# Altium project Buck converter.PrjPcb
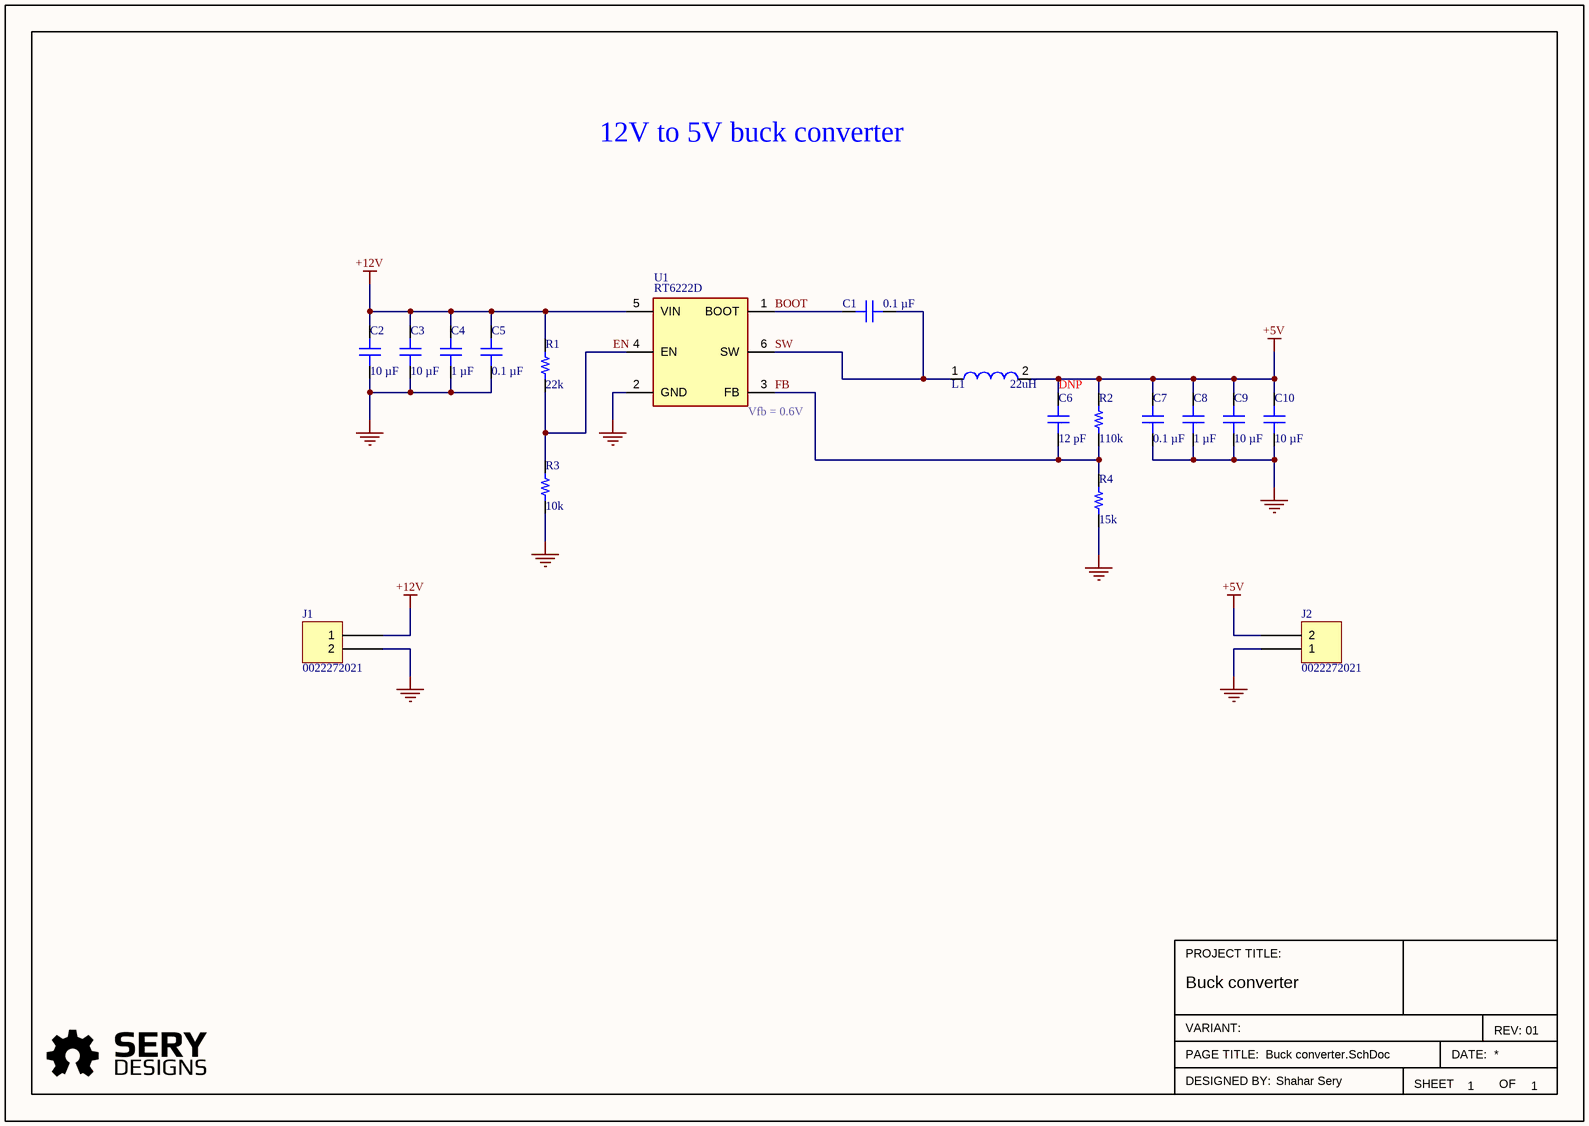
[diagram p0: Buck converter.SchDoc]
drawnby: Shahar Sery; project: Buck converter; revision: 01
1 sheet, 20 parts. Net scope: global (net labels, ports and power ports of the same name join across sheets).
Board file: Buck converter.PcbDoc

## Sheet Buck converter.SchDoc
size 297 x 209 mm; SheetNumber: 1; SheetTotal: 1

### Parts
C1  0.1 µF  [CAP 0402_1005]
C2  10 µF  [CAP 0805_2012]
C3  10 µF  [CAP 0805_2012]
C4  1 µF  [CAP 0603_1608]
C5  0.1 µF  [CAP 0402_1005]
C6  12 pF  [CAP 0402_1005]
C7  0.1 µF  [CAP 0402_1005]
C8  1 µF  [CAP 0603_1608]
C9  10 µF  [CAP 0805_2012]
C10  10 µF  [CAP 0805_2012]
J1  0022272021  [MOLEX KK 0022272021]
J2  0022272021  [MOLEX KK 0022272021]
L1  22uH  [NRS8040T220MJGJV]
OSHW-logo1  OSHW-logo  [OSHW-logo]  (value not drawn)  (no BOM)
R1  22k  [RES 0402_1005]
R2  110k  [RES 0402_1005]
R3  10k  [RES 0402_1005]
R4  15k  [RES 0402_1005]
SeryDesigns-logo1  SeryDesigns-logo  [SeryDesigns-logo]  (value not drawn)  (no BOM)
U1  RT6222D  [sot23-6]

### Nets
+5V: C6.2 C7.2 C8.2 C9.2 C10.2 J2.2 L1.2 R2.2
+12V: C2.2 C3.2 C4.2 C5.2 J1.1 R1.2 U1.5(VIN)
GND: C2.1 C3.1 C4.1 C5.1 C7.1 C8.1 C9.1 C10.1 J1.2 J2.1 R3.1 R4.1 U1.2(GND)
BOOT: C1.2 U1.1(BOOT)
EN: R1.1 R3.2 U1.4(EN)
FB: C6.1 R2.1 R4.2 U1.3(FB)
SW: C1.1 L1.1 U1.6(SW)

### Notes on the sheet
- 12V to 5V buck converter
- (near C6) DNP
- (near U1) Vfb = 0.6V
- PROJECT TITLE:
- VARIANT:
- PAGE TITLE:
- SHEET
- DATE:
- REV:
- OF
- DESIGNED BY:

### Library data of the parts
C1 C5 C7 = GRT155R71H104KE01D: CAP CER 0.1UF 50V X7R 0402; manufacturer: Murata Electronics; Tolerance: ±10%; Part Number: GRT155R71H104KE01D; Value: 0.1 µF; Applications: Automotive; Capacitance: 0.1 µF; componentlink2description: DigiKey Link; componentlink2url: https://www.digikey.com/en/products/detail/murata-electronics/GRT155R71H104KE01D/10704679; Device Package: 0402 (1005 Metric); lastupdated: 9/19/2022 12:56:46 PM; Lifecycle Status: Active; Minimum Order: 1; Mounting Type: Surface Mount, MLCC; Operating Temperature: -55°C ~ 125°C; Package / Case: 0402 (1005 Metric); packaging: TapeAndReel; partid: 44223; Part Status: Active; price: 0.01; Ratings: AEC-Q200; series: GRT; Size / Dimension: 0.039" L x 0.020" W (1.00mm x 0.50mm); Supplier 1: DigiKey; Supplier Part Number 1: 490-GRT155R71H104KE01DCT-ND; Temperature Coefficient: X7R; Thickness (Max): 0.022" (0.55mm); Voltage - Rated: 50V
C2 C3 C9 C10 = GRM21BR61H106ME43L: CAP CER 10UF 50V X5R 0805; manufacturer: Murata Electronics; Tolerance: ±20%; Part Number: GRM21BR61H106ME43L; Value: 10 µF; Applications: General Purpose; Capacitance: 10 µF; componentlink1description: Datasheet; componentlink1url: https://search.murata.co.jp/Ceramy/image/img/A01X/G101/ENG/GRM21BR61H106ME43-01A.pdf; componentlink2description: DigiKey Link; componentlink2url: https://www.digikey.com/en/products/detail/murata-electronics/GRM21BR61H106ME43L/10326317; Device Package: 0805 (2012 Metric); lastupdated: 9/19/2022 1:04:12 PM; Lifecycle Status: Active; Minimum Order: 1; Mounting Type: Surface Mount, MLCC; Operating Temperature: -55°C ~ 85°C; Package / Case: 0805 (2012 Metric); packaging: TapeAndReel; partid: 41295; Part Status: Active; price: 0.08; series: GRM; Size / Dimension: 0.079" L x 0.049" W (2.00mm x 1.25mm); Supplier 1: DigiKey; Supplier Part Number 1: 490-18664-1-ND; Temperature Coefficient: X5R; Thickness (Max): 0.057" (1.45mm); Voltage - Rated: 50V
C4 C8 = UMK107AB7105KA-T: CAP CER 1UF 50V X7R 0603; manufacturer: Taiyo Yuden; Tolerance: ±10%; Part Number: UMK107AB7105KA-T; Value: 1 µF; Applications: SMPS Filtering; Capacitance: 1 µF; componentlink1description: Datasheet; componentlink1url: https://www.yuden.co.jp/productdata/catalog/mlcc01_e.pdf; componentlink2description: DigiKey Link; componentlink2url: https://www.digikey.com/en/products/detail/taiyo-yuden/UMK107AB7105KA-T/3660085; Device Package: 0603 (1608 Metric); lastupdated: 9/19/2022 1:00:51 PM; Lifecycle Status: Active; Minimum Order: 1; Mounting Type: Surface Mount, MLCC; Operating Temperature: -55°C ~ 125°C; Package / Case: 0603 (1608 Metric); packaging: TapeAndReel; partid: 46688; Part Status: Active; price: 0.04; series: M; Size / Dimension: 0.063" L x 0.031" W (1.60mm x 0.80mm); Supplier 1: DigiKey; Supplier Part Number 1: 587-3247-1-ND; Temperature Coefficient: X7R; Thickness (Max): 0.037" (0.95mm); Voltage - Rated: 50V
C6 = GCM1555C1H120JA16D: CAP CER 12PF 50V C0G/NP0 0402; manufacturer: Murata Electronics; Temperature Coefficient: C0G, NP0; Tolerance: ±5%; Part Number: GCM1555C1H120JA16D; Value: 12 pF; Applications: Automotive; Capacitance: 12 pF; componentlink1description: Datasheet; componentlink1url: https://www.murata.com/~/media/webrenewal/support/library/catalog/products/capacitor/mlcc/c03e.ashx?la=en-us; componentlink2description: DigiKey Link; componentlink2url: https://www.digikey.com/en/products/detail/murata-electronics/GCM1555C1H120JA16D/4903551; Device Package: 0402 (1005 Metric); lastupdated: 9/19/2022 12:57:22 PM; Lifecycle Status: Active; Minimum Order: 1; Mounting Type: Surface Mount, MLCC; Operating Temperature: -55°C ~ 125°C; Package / Case: 0402 (1005 Metric); packaging: TapeAndReel; partid: 5824; Part Status: Active; price: 0.01; Ratings: AEC-Q200; series: GCM; Size / Dimension: 0.039" L x 0.020" W (1.00mm x 0.50mm); Supplier 1: DigiKey; Supplier Part Number 1: 490-12649-1-ND; Thickness (Max): 0.022" (0.55mm); Voltage - Rated: 50V
J1 J2 = 0022272021: CONN HEADER VERT 2POS 2.54MM; Manufacturer: Molex; Contact Length - Mating: 0.295" (7.49mm); Contact Length - Post: 0.140" (3.56mm); Material Flammability Rating: UL94 V-0; Number of Positions: 2; Number of Positions Loaded: All; Overall Contact Length: 0.560" (14.22mm); Pitch - Mating: 0.100" (2.54mm); Shrouding: Shrouded - 1 Wall; Style: Board to Cable/Wire; Part Number: 0022272021; ComponentLink1Description: Datasheet; ComponentLink1URL: https://www.molex.com/pdm_docs/sd/022272021_sd.pdf; ComponentLink2Description: DigiKey Link; ComponentLink2URL: http://digikey.com/product-detail/en/molex/0022272021/WM4111-ND/1130577; Connector Type: Header; Contact Finish - Mating: Tin; Contact Finish - Post: Tin; Contact Finish Thickness - Mating: 100.0µin (2.54µm); Contact Material: Brass; Contact Shape: Square; Contact Type: Male Pin; Fastening Type: Friction Lock; Insulation Color: Natural; Insulation Height: 0.461" (11.70mm); Insulation Material: Polyamide (PA), Nylon; LastUpdated: 1/12/2020 11:51:43 PM; Lifecycle Status: Active; Minimum Order: 1; Mounting Type: Through Hole; Number of Rows: 1; Packaging: Bulk; PartId: 76; Part Status: Active; Price: 0.27; Series: KK 6410; Supplier 1: DigiKey; Supplier Part Number 1: WM4111-ND; Termination: Solder
L1 = NRS8040T220MJGJV: Inductor, Fixed, SMD, 22µH, 2.2A; Part Number: 6006M0220F000; MF: Taiyo Yuden; Tolerance: ±20%; Temp Range: -40°C ~ 125°C; MPN: NRS8040T220MJGJV; Family: Inductors (Fixed); Package: Custom SMT; Value: 22µH; Power: N/A; Voltage: N/A; Special: N/A; Mount Type: SMT; Supplier 1: Digi-Key; Supplier Part Number 1: 587-3655-2-ND; Current: 2.2A; ComponentLink1Description: Datasheet; ComponentLink1URL: https://ds.yuden.co.jp/TYCOMPAS/ut/detail?pn=LCXNH8080YKL220MJG&u=M
OSHW-logo1 = OSHW-logo: OSHW logo, no writing
R1 = CR0402-FX-2202GLF: RES SMD 22K OHM 1% 1/16W 0402; Manufacturer: Bourns Inc.; Power (Watts): 0.063W, 1/16W; Resistance: 22 kOhms; Temperature Coefficient: ±100ppm/°C; Part Number: CR0402-FX-2202GLF; Value: 22k; ComponentLink1Description: Datasheet; ComponentLink1URL: https://www.bourns.com/docs/Product-Datasheets/CR0402.pdf; ComponentLink2Description: DigiKey Link; ComponentLink2URL: https://www.digikey.com/en/products/detail/bourns-inc/CR0402-FX-2202GLF/3783230; Composition: Thick Film; Device Package: 0402 (1005 Metric); Height - Seated (Max): 0.016" (0.40mm); LastUpdated: 9/19/2022 1:14:50 PM; Lifecycle Status: Active; Minimum Order: 1; Number of Terminations: 2; Operating Temperature: -55°C ~ 155°C; Package / Case: 0402 (1005 Metric); Packaging: CutTape; PartId: 6638; Part Status: Active; Price: 0.01; Series: CR0402; Size / Dimension: 0.039" L x 0.020" W (1.00mm x 0.50mm); Supplier 1: DigiKey; Supplier Part Number 1: CR0402-FX-2202GLFCT-ND; Supplier Device Package: 0402; Tolerance: ±1%
R2 = AF0402FR-07110KL: RES SMD 110K OHM 1% 1/16W 0402; Manufacturer: Yageo; Power (Watts): 0.063W, 1/16W; Resistance: 110 kOhms; Temperature Coefficient: ±100ppm/°C; Part Number: AF0402FR-07110KL; Value: 110k; ComponentLink1Description: Datasheet; ComponentLink1URL: https://www.yageo.com/upload/media/product/productsearch/datasheet/rchip/PYu-AF_51_RoHS_L_6.pdf; ComponentLink2Description: DigiKey Link; ComponentLink2URL: https://www.digikey.com/en/products/detail/yageo/AF0402FR-07110KL/5900404; Composition: Thick Film; Device Package: 0402 (1005 Metric); Features: Anti-Sulfur, Automotive AEC-Q200; Height - Seated (Max): 0.015" (0.37mm); LastUpdated: 9/19/2022 1:13:54 PM; Lifecycle Status: Active; Minimum Order: 1; Number of Terminations: 2; Operating Temperature: -55°C ~ 155°C; Package / Case: 0402 (1005 Metric); Packaging: TapeAndReel; PartId: 60378; Part Status: Active; Price: 0.01; Ratings: AEC-Q200; Series: AF; Size / Dimension: 0.039" L x 0.020" W (1.00mm x 0.50mm); Supplier 1: DigiKey; Supplier Part Number 1: 13-AF0402FR-07110KLCT-ND; Supplier Device Package: 0402; Tolerance: ±1%
R3 = RE0402FRE0710KL: RES SMD 10K OHM 1% 1/16W 0402; Manufacturer: Yageo; Power (Watts): 0.063W, 1/16W; Resistance: 10 kOhms; Temperature Coefficient: ±50ppm/°C; Part Number: RE0402FRE0710KL; Value: 10k; ComponentLink1Description: Datasheet; ComponentLink1URL: https://www.yageo.com/upload/media/product/productsearch/datasheet/rchip/PYu-RE_105_RoHS_L_6.pdf; ComponentLink2Description: DigiKey Link; ComponentLink2URL: https://www.digikey.com/en/products/detail/yageo/RE0402FRE0710KL/5922980; Composition: Thick Film; Device Package: 0402 (1005 Metric); Height - Seated (Max): 0.015" (0.37mm); LastUpdated: 9/19/2022 1:13:38 PM; Lifecycle Status: Active; Minimum Order: 1; Number of Terminations: 2; Operating Temperature: -55°C ~ 155°C; Package / Case: 0402 (1005 Metric); Packaging: CutTape; PartId: 68060; Part Status: Active; Price: 0.01; Series: RE; Size / Dimension: 0.039" L x 0.020" W (1.00mm x 0.50mm); Supplier 1: DigiKey; Supplier Part Number 1: 13-RE0402FRE0710KLCT-ND; Supplier Device Package: 0402; Tolerance: ±1%
R4 = CRCW040215K0FKED: RES SMD 15K OHM 1% 1/16W 0402; Manufacturer: Vishay Dale; Power (Watts): 0.063W, 1/16W; Resistance: 15 kOhms; Temperature Coefficient: ±100ppm/°C; Part Number: CRCW040215K0FKED; Value: 15k; ComponentLink1Description: Datasheet; ComponentLink1URL: http://www.vishay.com/docs/20035/dcrcwe3.pdf; ComponentLink2Description: DigiKey Link; ComponentLink2URL: https://www.digikey.com/en/products/detail/vishay-dale/CRCW040215K0FKED/1178139; Composition: Thick Film; Device Package: 0402 (1005 Metric); Features: Automotive AEC-Q200; Height - Seated (Max): 0.016" (0.40mm); LastUpdated: 9/19/2022 1:14:19 PM; Lifecycle Status: Active; Minimum Order: 1; Number of Terminations: 2; Operating Temperature: -55°C ~ 155°C; Package / Case: 0402 (1005 Metric); Packaging: CutTape; PartId: 16217; Part Status: Active; Price: 0.01; Ratings: AEC-Q200; Series: CRCW; Size / Dimension: 0.039" L x 0.020" W (1.00mm x 0.50mm); Supplier 1: DigiKey; Supplier Part Number 1: 541-15.0KLCT-ND; Supplier Device Package: 0402; Tolerance: ±1%
SeryDesigns-logo1 = SeryDesigns-logo: Sery designs logo
U1 = RT6222D: IC, SMD, 2A, 1.4MHz,  Synchronous Buck Converter, SOT-23-6; MPN: SGM61410; Part Number: 710GLSGM61410; MF: SGMicro; Value: SGM61410; Family: ICs; Package: SOT-23-6; Mount Type: SMT; Supplier 1: Digi-Key; Supplier Part Number 1: N/A; Temp Range: N/A; ComponentLink1Description: Datasheet; ComponentLink1URL: http://www.sg-micro.com/uploads/soft/20220513/1652411174.pdf